# Altium schematic sheet ui_conn.SchDoc: mcHF QRP Transceiver UI board
size A4; Author: K Atanassov; CompanyName: M0NKA; Revision: 0.6.3; SheetTotal: 5
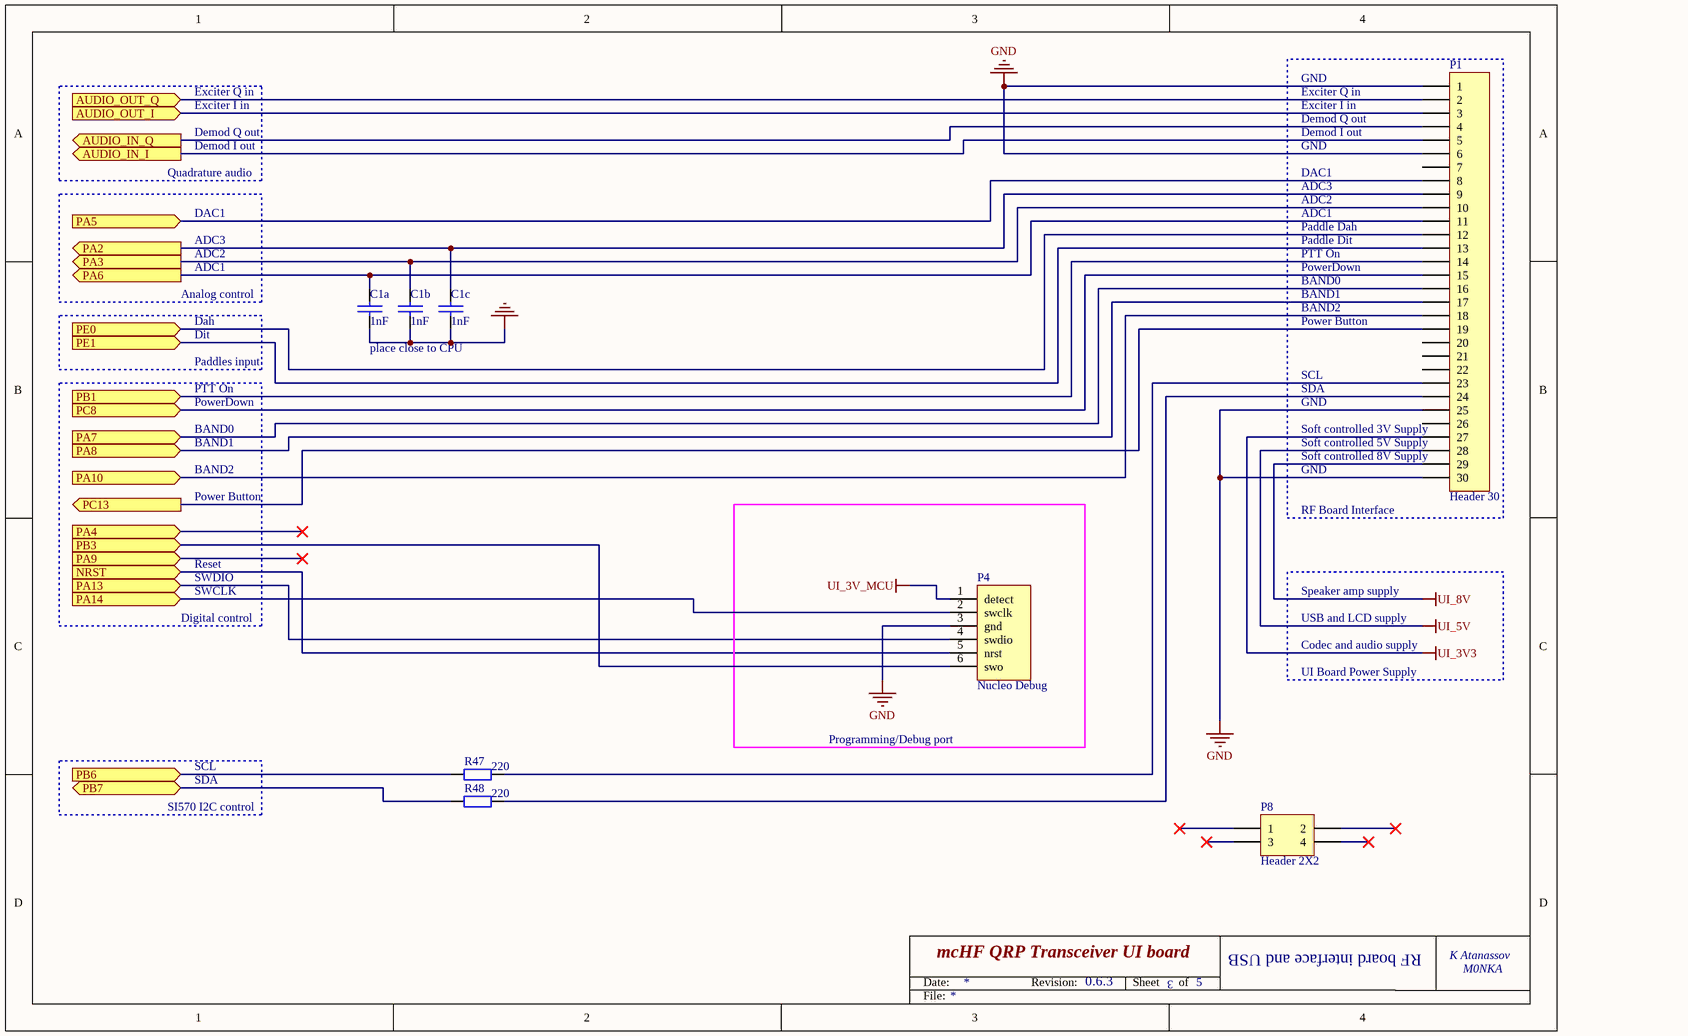
[diagram p0: ui_conn.SchDoc]

## Parts
C1a  1nF  [0805-Pro]
C1b  1nF  [0805-Pro]
C1c  1nF  [0805-Pro]
P1  Header 30  [HDR1X30]
P4  Nucleo Debug  [HDR1X6]  (no BOM)
P8  Header 2X2  [HDR2X2]
R47  220  [0805-Pro]
R48  220  [0805-Pro]

## Blocks framed on the sheet
Programming/Debug port: P4

## Ports
AUDIO_IN_I (out), AUDIO_IN_Q (out), AUDIO_OUT_I (in), AUDIO_OUT_Q (in), NRST (in), PA2 (out), PA3 (out), PA4 (in), PA5 (in), PA6 (out), PA7 (in), PA8 (in), PA9 (in), PA10 (in), PA13 (in), PA14 (in), PB1 (in), PB3 (in), PB6 (in), PB7 (bidir), PC8 (in), PC13 (out), PE0 (in), PE1 (in)

## Nets
GND: C1a.2 C1b.2 C1c.2 P1.1 P1.6 P1.25 P1.30 P4.3(gnd)
UI_3V3: P1.27
UI_3V_MCU: P4.1(detect)
UI_5V: P1.28
UI_8V: P1.29
AUDIO_IN_I: P1.5 ; port AUDIO_IN_I
AUDIO_IN_Q: P1.4 ; port AUDIO_IN_Q
AUDIO_OUT_I: P1.3 ; port AUDIO_OUT_I
AUDIO_OUT_Q: P1.2 ; port AUDIO_OUT_Q
NRST: P4.5(nrst) ; port NRST
PA2: C1c.1 P1.9 ; port PA2
PA3: C1b.1 P1.10 ; port PA3
PA5: P1.8 ; port PA5
PA6: C1a.1 P1.11 ; port PA6
PA7: P1.16 ; port PA7
PA8: P1.17 ; port PA8
PA10: P1.18 ; port PA10
PA13: P4.4(swdio) ; port PA13
PA14: P4.2(swclk) ; port PA14
PB1: P1.14 ; port PB1
PB3: P4.6(swo) ; port PB3
PB6: R47.1 ; port PB6
PB7: R48.1 ; port PB7
PC8: P1.15 ; port PC8
PC13: P1.19 ; port PC13
PE0: P1.12 ; port PE0
PE1: P1.13 ; port PE1
NetP1_23: P1.23 R47.2
NetP1_24: P1.24 R48.2

Not connected (* = marked no-connect by the designer): P1 7 20 21 22 26; P8 1* 2* 3* 4*

## Notes on the sheet
- Exciter Q in
- Exciter I in
- GND
- Quadrature audio
- Demod Q out
- Demod I out
- DAC1
- ADC3
- ADC2
- ADC1
- Paddle Dit
- Paddle Dah
- Analog control
- PTT On
- PowerDown
- BAND0
- BAND1
- BAND2
- Dit
- Dah
- Paddles input
- place close to CPU
- SCL
- Power Button
- SDA
- (near P1) Soft controlled 3V Supply
- (near P1) Soft controlled 5V Supply
- (near P1) RF Board Interface
- (near P1) Soft controlled 8V Supply
- SWDIO
- Reset
- Digital control
- SWCLK
- Speaker amp supply
- USB and LCD supply
- Codec and audio supply
- UI Board Power Supply
- SI570 I2C control
- 3
- RF board interface and USB
- Date:
- Revision:
- Sheet
- of
- File:

## Library data of the parts
C1a C1b C1c = CAP: Capacitor; Order: FN 185-6408; QT Order: QCC-00259; Price: 0.01
P1 = Header 30: Header, 30-Pin; Order: NA; Price: 0.295
P4 = Nucleo_6: ST Nucleo 6 pin header
P8 = Header 2X2: Header, 2-Pin, Dual row; LatestRevisionDate: 17-Jul-2002; LatestRevisionNote: Re-released for DXP Platform.; Publisher: Altium Limited
R47 R48 = RES: Resistor; Order: FN 933-2804; QT Order: QCR-00309; Price: 0.007